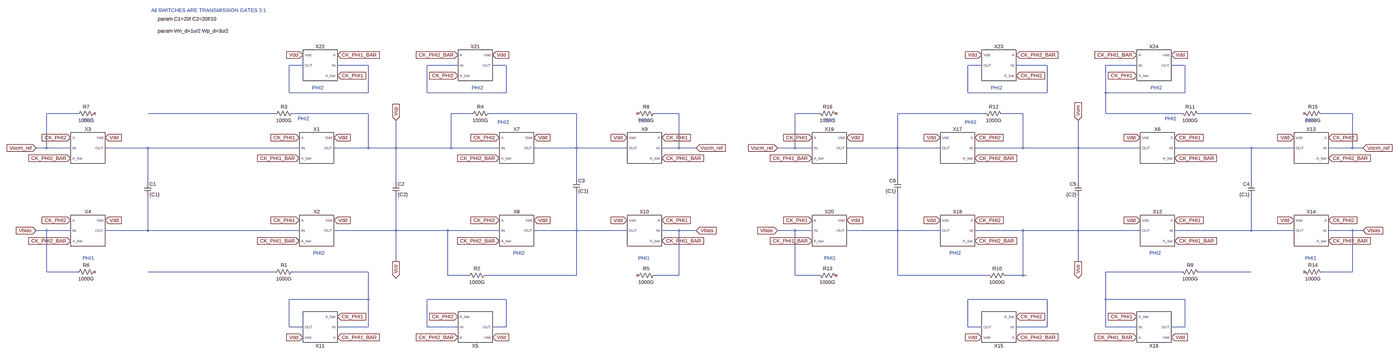
[diagram p0: schematic CS_CMFB_V2.asc, whole sheet]
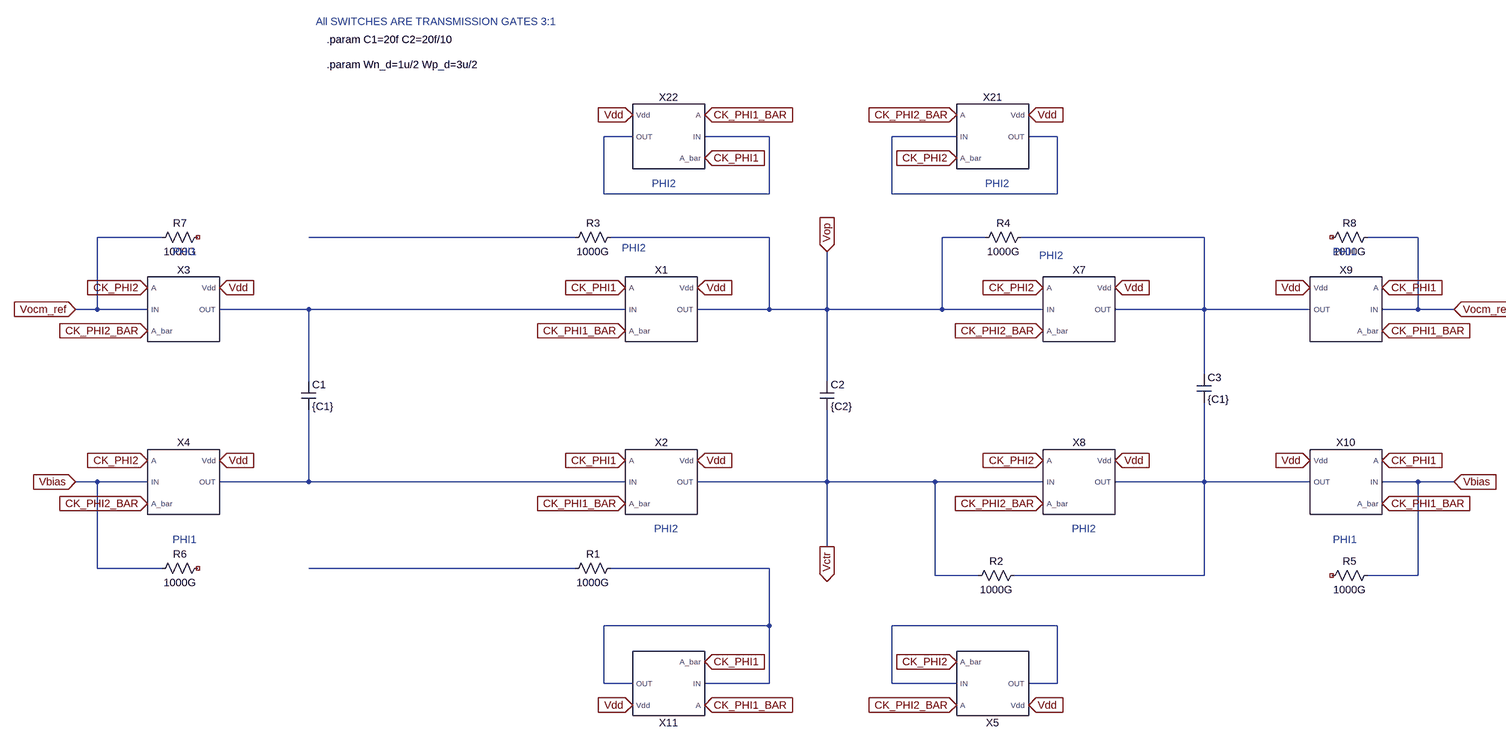
[diagram p1: schematic CS_CMFB_V2.asc, part, row 1 of 1, column 1 of 2]
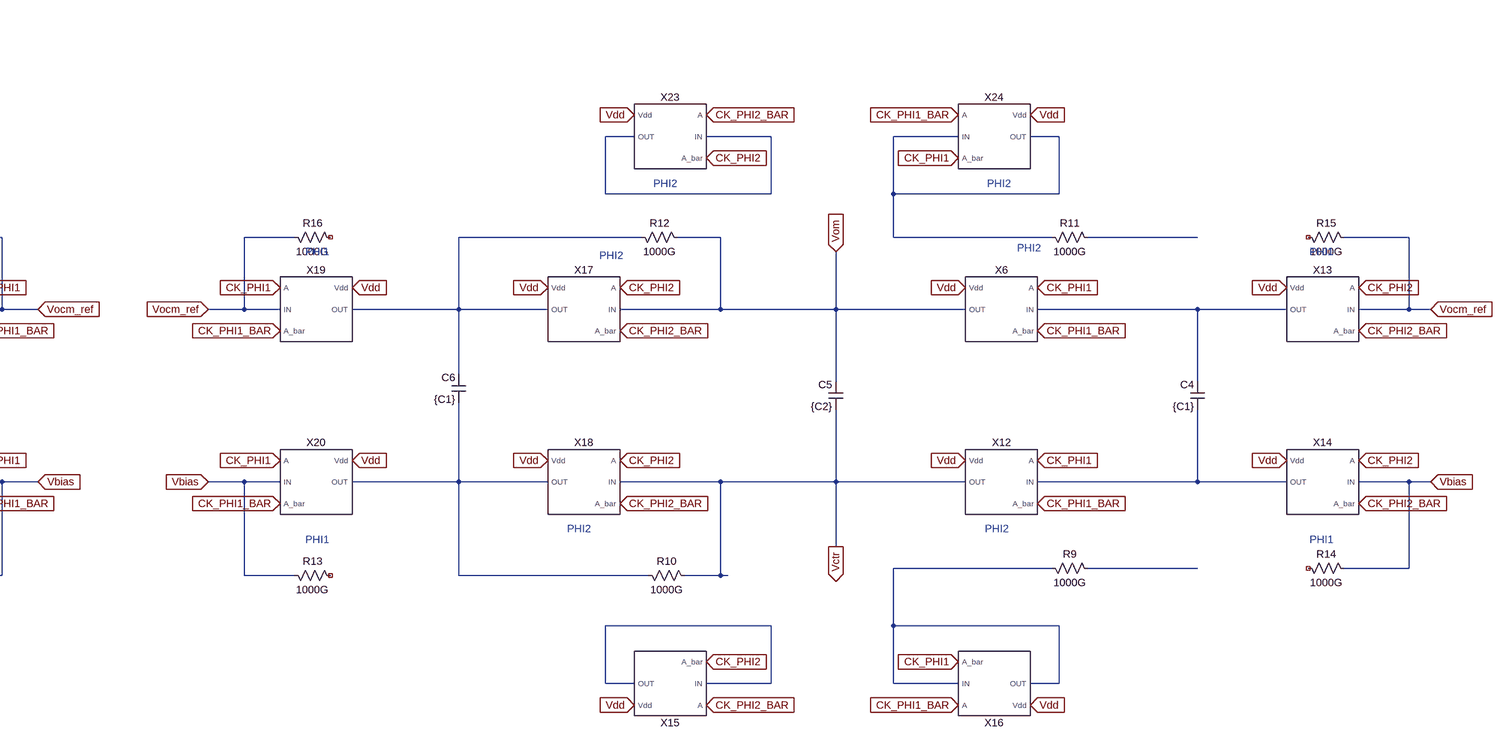
[diagram p2: schematic CS_CMFB_V2.asc, part, row 1 of 1, column 2 of 2]
CS_CMFB_V2.asc, the LTspice schematic file:
Version 4
SHEET 1 4968 1400
WIRE -1040 -368 -1104 -368
WIRE -736 -368 -880 -368
WIRE -320 -368 -464 -368
WIRE -96 -368 -160 -368
WIRE 2672 -368 2608 -368
WIRE 2976 -368 2832 -368
WIRE 3392 -368 3248 -368
WIRE 3616 -368 3552 -368
WIRE -1104 -240 -1104 -368
WIRE -736 -240 -736 -368
WIRE -736 -240 -1104 -240
WIRE -464 -240 -464 -368
WIRE -96 -240 -96 -368
WIRE -96 -240 -464 -240
WIRE 2608 -240 2608 -368
WIRE 2976 -240 2976 -368
WIRE 2976 -240 2608 -240
WIRE 3248 -240 3248 -368
WIRE 3616 -240 3616 -368
WIRE 3616 -240 3248 -240
WIRE -2096 -144 -2240 -144
WIRE -1168 -144 -1760 -144
WIRE -736 -144 -1088 -144
WIRE -256 -144 -352 -144
WIRE 320 -144 -176 -144
WIRE 832 -144 720 -144
WIRE 1792 -144 1680 -144
WIRE 2688 -144 2192 -144
WIRE 2864 -144 2768 -144
WIRE 3248 -144 3248 -240
WIRE 3600 -144 3248 -144
WIRE 4272 -144 3680 -144
WIRE 4752 -144 4608 -144
WIRE -2240 16 -2240 -144
WIRE -2240 16 -2288 16
WIRE -2128 16 -2240 16
WIRE -1760 16 -1968 16
WIRE -1056 16 -1760 16
WIRE -736 16 -736 -144
WIRE -736 16 -896 16
WIRE -608 16 -608 -112
WIRE -608 16 -736 16
WIRE -352 16 -352 -144
WIRE -352 16 -608 16
WIRE -128 16 -352 16
WIRE 320 16 320 -144
WIRE 320 16 32 16
WIRE 592 16 320 16
WIRE 832 16 832 -144
WIRE 832 16 752 16
WIRE 912 16 832 16
WIRE 1680 16 1680 -144
WIRE 1680 16 1600 16
WIRE 1760 16 1680 16
WIRE 2192 16 2192 -144
WIRE 2192 16 1920 16
WIRE 2480 16 2192 16
WIRE 2864 16 2864 -144
WIRE 2864 16 2640 16
WIRE 3120 16 3120 -112
WIRE 3120 16 2864 16
WIRE 3408 16 3120 16
WIRE 4272 16 3568 16
WIRE 4480 16 4272 16
WIRE 4752 16 4752 -144
WIRE 4752 16 4640 16
WIRE 4800 16 4752 16
WIRE 320 160 320 16
WIRE 2192 160 2192 16
WIRE -1760 176 -1760 16
WIRE -608 176 -608 16
WIRE 3120 176 3120 16
WIRE 4272 176 4272 16
WIRE -2240 400 -2288 400
WIRE -2128 400 -2240 400
WIRE -1760 400 -1760 240
WIRE -1760 400 -1968 400
WIRE -1056 400 -1760 400
WIRE -608 400 -608 240
WIRE -608 400 -896 400
WIRE -368 400 -608 400
WIRE -128 400 -368 400
WIRE 320 400 320 224
WIRE 320 400 32 400
WIRE 592 400 320 400
WIRE 832 400 752 400
WIRE 912 400 832 400
WIRE 1680 400 1600 400
WIRE 1760 400 1680 400
WIRE 2192 400 2192 224
WIRE 2192 400 1920 400
WIRE 2480 400 2192 400
WIRE 2864 400 2640 400
WIRE 3120 400 3120 240
WIRE 3120 400 2864 400
WIRE 3408 400 3120 400
WIRE 4272 400 4272 240
WIRE 4272 400 3568 400
WIRE 4480 400 4272 400
WIRE 4752 400 4640 400
WIRE 4800 400 4752 400
WIRE -608 544 -608 400
WIRE 3120 544 3120 400
WIRE -2240 592 -2240 400
WIRE -2096 592 -2240 592
WIRE -1168 592 -1760 592
WIRE -736 592 -1088 592
WIRE 3600 592 3248 592
WIRE 4272 592 3680 592
WIRE 4752 592 4752 400
WIRE 4752 592 4608 592
WIRE -368 608 -368 400
WIRE -272 608 -368 608
WIRE 320 608 320 400
WIRE 320 608 -192 608
WIRE 832 608 832 400
WIRE 832 608 720 608
WIRE 1680 608 1680 400
WIRE 1792 608 1680 608
WIRE 2192 608 2192 400
WIRE 2704 608 2192 608
WIRE 2864 608 2864 400
WIRE 2864 608 2784 608
WIRE 2880 608 2864 608
WIRE -736 720 -736 592
WIRE -736 720 -1104 720
WIRE -96 720 -464 720
WIRE 2976 720 2608 720
WIRE 3248 720 3248 592
WIRE 3616 720 3248 720
WIRE -1104 848 -1104 720
WIRE -1040 848 -1104 848
WIRE -736 848 -736 720
WIRE -736 848 -880 848
WIRE -464 848 -464 720
WIRE -320 848 -464 848
WIRE -96 848 -96 720
WIRE -96 848 -160 848
WIRE 2608 848 2608 720
WIRE 2672 848 2608 848
WIRE 2976 848 2976 720
WIRE 2976 848 2832 848
WIRE 3248 848 3248 720
WIRE 3392 848 3248 848
WIRE 3616 848 3616 720
WIRE 3616 848 3552 848
FLAG -2288 16 Vocm_ref
IOPIN -2288 16 In
FLAG -608 -112 Vop
IOPIN -608 -112 In
FLAG -1968 -32 Vdd
IOPIN -1968 -32 In
FLAG -896 -32 Vdd
IOPIN -896 -32 In
FLAG -896 352 Vdd
IOPIN -896 352 In
FLAG -1968 352 Vdd
IOPIN -1968 352 In
FLAG -2128 -32 CK_PHI2
IOPIN -2128 -32 In
FLAG -2128 352 CK_PHI2
IOPIN -2128 352 In
FLAG -1056 -32 CK_PHI1
IOPIN -1056 -32 In
FLAG -1056 352 CK_PHI1
IOPIN -1056 352 In
FLAG -2128 64 CK_PHI2_BAR
IOPIN -2128 64 In
FLAG -2128 448 CK_PHI2_BAR
IOPIN -2128 448 In
FLAG -1056 64 CK_PHI1_BAR
IOPIN -1056 64 In
FLAG -1056 448 CK_PHI1_BAR
IOPIN -1056 448 In
FLAG -2288 400 Vbias
IOPIN -2288 400 In
FLAG -608 544 Vctr
IOPIN -608 544 Out
FLAG -160 896 Vdd
IOPIN -160 896 In
FLAG -320 896 CK_PHI2_BAR
IOPIN -320 896 In
FLAG -320 800 CK_PHI2
IOPIN -320 800 In
FLAG -1040 896 Vdd
IOPIN -1040 896 In
FLAG -880 896 CK_PHI1_BAR
IOPIN -880 896 In
FLAG -880 800 CK_PHI1
IOPIN -880 800 In
FLAG 32 -32 Vdd
IOPIN 32 -32 In
FLAG 32 352 Vdd
IOPIN 32 352 In
FLAG -128 -32 CK_PHI2
IOPIN -128 -32 In
FLAG -128 352 CK_PHI2
IOPIN -128 352 In
FLAG -128 64 CK_PHI2_BAR
IOPIN -128 64 In
FLAG -128 448 CK_PHI2_BAR
IOPIN -128 448 In
FLAG 912 16 Vocm_ref
IOPIN 912 16 In
FLAG 592 -32 Vdd
IOPIN 592 -32 In
FLAG 592 352 Vdd
IOPIN 592 352 In
FLAG 752 -32 CK_PHI1
IOPIN 752 -32 In
FLAG 752 352 CK_PHI1
IOPIN 752 352 In
FLAG 752 64 CK_PHI1_BAR
IOPIN 752 64 In
FLAG 752 448 CK_PHI1_BAR
IOPIN 752 448 In
FLAG 912 400 Vbias
IOPIN 912 400 In
FLAG -160 -416 Vdd
IOPIN -160 -416 In
FLAG -320 -416 CK_PHI2_BAR
IOPIN -320 -416 In
FLAG -320 -320 CK_PHI2
IOPIN -320 -320 In
FLAG -1040 -416 Vdd
IOPIN -1040 -416 In
FLAG -880 -416 CK_PHI1_BAR
IOPIN -880 -416 In
FLAG -880 -320 CK_PHI1
IOPIN -880 -320 In
FLAG 4800 16 Vocm_ref
IOPIN 4800 16 In
FLAG 3120 -112 Vom
IOPIN 3120 -112 In
FLAG 4480 -32 Vdd
IOPIN 4480 -32 In
FLAG 3408 -32 Vdd
IOPIN 3408 -32 In
FLAG 3408 352 Vdd
IOPIN 3408 352 In
FLAG 4480 352 Vdd
IOPIN 4480 352 In
FLAG 4640 -32 CK_PHI2
IOPIN 4640 -32 In
FLAG 4640 352 CK_PHI2
IOPIN 4640 352 In
FLAG 3568 -32 CK_PHI1
IOPIN 3568 -32 In
FLAG 3568 352 CK_PHI1
IOPIN 3568 352 In
FLAG 4640 64 CK_PHI2_BAR
IOPIN 4640 64 In
FLAG 4640 448 CK_PHI2_BAR
IOPIN 4640 448 In
FLAG 3568 64 CK_PHI1_BAR
IOPIN 3568 64 In
FLAG 3568 448 CK_PHI1_BAR
IOPIN 3568 448 In
FLAG 4800 400 Vbias
IOPIN 4800 400 In
FLAG 3120 544 Vctr
IOPIN 3120 544 Out
FLAG 2672 896 Vdd
IOPIN 2672 896 In
FLAG 2832 896 CK_PHI2_BAR
IOPIN 2832 896 In
FLAG 2832 800 CK_PHI2
IOPIN 2832 800 In
FLAG 3552 896 Vdd
IOPIN 3552 896 In
FLAG 3392 896 CK_PHI1_BAR
IOPIN 3392 896 In
FLAG 3392 800 CK_PHI1
IOPIN 3392 800 In
FLAG 2480 -32 Vdd
IOPIN 2480 -32 In
FLAG 2480 352 Vdd
IOPIN 2480 352 In
FLAG 2640 -32 CK_PHI2
IOPIN 2640 -32 In
FLAG 2640 352 CK_PHI2
IOPIN 2640 352 In
FLAG 2640 64 CK_PHI2_BAR
IOPIN 2640 64 In
FLAG 2640 448 CK_PHI2_BAR
IOPIN 2640 448 In
FLAG 1600 16 Vocm_ref
IOPIN 1600 16 In
FLAG 1920 -32 Vdd
IOPIN 1920 -32 In
FLAG 1920 352 Vdd
IOPIN 1920 352 In
FLAG 1760 -32 CK_PHI1
IOPIN 1760 -32 In
FLAG 1760 352 CK_PHI1
IOPIN 1760 352 In
FLAG 1760 64 CK_PHI1_BAR
IOPIN 1760 64 In
FLAG 1760 448 CK_PHI1_BAR
IOPIN 1760 448 In
FLAG 1600 400 Vbias
IOPIN 1600 400 In
FLAG 2672 -416 Vdd
IOPIN 2672 -416 In
FLAG 2832 -416 CK_PHI2_BAR
IOPIN 2832 -416 In
FLAG 2832 -320 CK_PHI2
IOPIN 2832 -320 In
FLAG 3552 -416 Vdd
IOPIN 3552 -416 In
FLAG 3392 -416 CK_PHI1_BAR
IOPIN 3392 -416 In
FLAG 3392 -320 CK_PHI1
IOPIN 3392 -320 In
SYMBOL tgate -976 16 R0
SYMATTR InstName X1
SYMBOL tgate -976 400 R0
SYMATTR InstName X2
SYMBOL tgate -2048 16 R0
SYMATTR InstName X3
SYMBOL tgate -2048 400 R0
SYMATTR InstName X4
SYMBOL cap -1776 176 R0
SYMATTR InstName C1
SYMATTR Value {C1}
SYMBOL cap -624 176 R0
SYMATTR InstName C2
SYMATTR Value {C2}
SYMBOL tgate -240 848 M180
SYMATTR SpiceLine L=0.28u Wn={Wn_d} Wp={Wp_d} M=1
SYMATTR InstName X5
SYMBOL tgate -960 848 R180
SYMATTR SpiceLine L=0.28u Wn={Wn_d} Wp={Wp_d} M=1
SYMATTR InstName X11
SYMBOL tgate -48 16 R0
SYMATTR InstName X7
SYMBOL tgate -48 400 R0
SYMATTR InstName X8
SYMBOL tgate 672 16 M0
SYMATTR InstName X9
SYMBOL tgate 672 400 M0
SYMATTR InstName X10
SYMBOL cap 304 160 R0
SYMATTR InstName C3
SYMATTR Value {C1}
SYMBOL tgate -240 -368 R0
SYMATTR SpiceLine L=0.28u Wn={Wn_d} Wp={Wp_d} M=1
SYMATTR InstName X21
SYMBOL tgate -960 -368 M0
SYMATTR SpiceLine L=0.28u Wn={Wn_d} Wp={Wp_d} M=1
SYMATTR InstName X22
SYMBOL res -1072 576 R90
WINDOW 0 0 56 VBottom 2
WINDOW 3 32 56 VTop 2
SYMATTR InstName R1
SYMATTR Value 1000G
SYMBOL res -176 592 R90
WINDOW 0 0 56 VBottom 2
WINDOW 3 32 56 VTop 2
SYMATTR InstName R2
SYMATTR Value 1000G
SYMBOL res -1072 -160 R90
WINDOW 0 0 56 VBottom 2
WINDOW 3 32 56 VTop 2
SYMATTR InstName R3
SYMATTR Value 1000G
SYMBOL res -160 -160 R90
WINDOW 0 0 56 VBottom 2
WINDOW 3 32 56 VTop 2
SYMATTR InstName R4
SYMATTR Value 1000G
SYMBOL res 736 592 R90
WINDOW 0 0 56 VBottom 2
WINDOW 3 32 56 VTop 2
SYMATTR InstName R5
SYMATTR Value 1000G
SYMBOL res -2000 576 R90
WINDOW 0 0 56 VBottom 2
WINDOW 3 32 56 VTop 2
SYMATTR InstName R6
SYMATTR Value 1000G
SYMBOL res -2000 -160 R90
WINDOW 0 0 56 VBottom 2
WINDOW 3 32 56 VTop 2
SYMATTR InstName R7
SYMATTR Value 1000G
SYMBOL res 736 -160 R90
WINDOW 0 0 56 VBottom 2
WINDOW 3 32 56 VTop 2
SYMATTR InstName R8
SYMATTR Value 1000G
SYMBOL tgate 3488 16 M0
SYMATTR InstName X6
SYMBOL tgate 3488 400 M0
SYMATTR InstName X12
SYMBOL tgate 4560 16 M0
SYMATTR InstName X13
SYMBOL tgate 4560 400 M0
SYMATTR InstName X14
SYMBOL cap 4288 176 M0
SYMATTR InstName C4
SYMATTR Value {C1}
SYMBOL cap 3136 176 M0
SYMATTR InstName C5
SYMATTR Value {C2}
SYMBOL tgate 2752 848 R180
SYMATTR SpiceLine L=0.28u Wn={Wn_d} Wp={Wp_d} M=1
SYMATTR InstName X15
SYMBOL tgate 3472 848 M180
SYMATTR SpiceLine L=0.28u Wn={Wn_d} Wp={Wp_d} M=1
SYMATTR InstName X16
SYMBOL tgate 2560 16 M0
SYMATTR InstName X17
SYMBOL tgate 2560 400 M0
SYMATTR InstName X18
SYMBOL tgate 1840 16 R0
SYMATTR InstName X19
SYMBOL tgate 1840 400 R0
SYMATTR InstName X20
SYMBOL cap 2208 160 M0
SYMATTR InstName C6
SYMATTR Value {C1}
SYMBOL tgate 2752 -368 M0
SYMATTR SpiceLine L=0.28u Wn={Wn_d} Wp={Wp_d} M=1
SYMATTR InstName X23
SYMBOL tgate 3472 -368 R0
SYMATTR SpiceLine L=0.28u Wn={Wn_d} Wp={Wp_d} M=1
SYMATTR InstName X24
SYMBOL res 3584 576 M90
WINDOW 0 0 56 VBottom 2
WINDOW 3 32 56 VTop 2
SYMATTR InstName R9
SYMATTR Value 1000G
SYMBOL res 2688 592 M90
WINDOW 0 0 56 VBottom 2
WINDOW 3 32 56 VTop 2
SYMATTR InstName R10
SYMATTR Value 1000G
SYMBOL res 3584 -160 M90
WINDOW 0 0 56 VBottom 2
WINDOW 3 32 56 VTop 2
SYMATTR InstName R11
SYMATTR Value 1000G
SYMBOL res 2672 -160 M90
WINDOW 0 0 56 VBottom 2
WINDOW 3 32 56 VTop 2
SYMATTR InstName R12
SYMATTR Value 1000G
SYMBOL res 1776 592 M90
WINDOW 0 0 56 VBottom 2
WINDOW 3 32 56 VTop 2
SYMATTR InstName R13
SYMATTR Value 1000G
SYMBOL res 4512 576 M90
WINDOW 0 0 56 VBottom 2
WINDOW 3 32 56 VTop 2
SYMATTR InstName R14
SYMATTR Value 1000G
SYMBOL res 4512 -160 M90
WINDOW 0 0 56 VBottom 2
WINDOW 3 32 56 VTop 2
SYMATTR InstName R15
SYMATTR Value 1000G
SYMBOL res 1776 -160 M90
WINDOW 0 0 56 VBottom 2
WINDOW 3 32 56 VTop 2
SYMATTR InstName R16
SYMATTR Value 1000G
TEXT -1064 -120 Left 2 ;PHI2
TEXT -992 504 Left 2 ;PHI2
TEXT -2072 -112 Left 2 ;PHI1
TEXT -2072 528 Left 2 ;PHI1
TEXT -1720 -584 Left 2 !.param C1=20f C2=20f/10
TEXT -1744 -624 Left 2 ;All SWITCHES ARE TRANSMISSION GATES 3:1
TEXT -1720 -528 Left 2 !.param Wn_d=1u/2 Wp_d=3u/2
TEXT -136 -104 Left 2 ;PHI2
TEXT -64 504 Left 2 ;PHI2
TEXT 696 -112 Right 2 ;PHI1
TEXT 696 528 Right 2 ;PHI1
TEXT -256 -264 Left 2 ;PHI2
TEXT -944 -264 Right 2 ;PHI2
TEXT 3576 -120 Right 2 ;PHI2
TEXT 3504 504 Right 2 ;PHI2
TEXT 4584 -112 Right 2 ;PHI1
TEXT 4584 528 Right 2 ;PHI1
TEXT 2648 -104 Right 2 ;PHI2
TEXT 2576 504 Right 2 ;PHI2
TEXT 1816 -112 Left 2 ;PHI1
TEXT 1816 528 Left 2 ;PHI1
TEXT 2768 -264 Right 2 ;PHI2
TEXT 3456 -264 Left 2 ;PHI2

The netlist it stands for:
* CS_CMFB_V2.asc
XX1 CK_PHI1 CK_PHI1_BAR N009 Vdd Vop tgate L=0.28u Wn=1u Wp=3u M=1  ; pins A A_bar IN Vdd OUT
XX2 CK_PHI1 CK_PHI1_BAR N011 Vdd Vctr tgate L=0.28u Wn=1u Wp=3u M=1  ; pins A A_bar IN Vdd OUT
XX3 CK_PHI2 CK_PHI2_BAR Vocm_ref Vdd N009 tgate L=0.28u Wn=1u Wp=3u M=1  ; pins A A_bar IN Vdd OUT
XX4 CK_PHI2 CK_PHI2_BAR Vbias Vdd N011 tgate L=0.28u Wn=1u Wp=3u M=1  ; pins A A_bar IN Vdd OUT
C1 N009 N011 {C1}
C2 Vop Vctr {C2}
XX5 CK_PHI2_BAR CK_PHI2 N019 Vdd N019 tgate L=0.28u Wn={Wn_d} Wp={Wp_d} M=1  ; pins A A_bar IN Vdd OUT
XX11 CK_PHI1_BAR CK_PHI1 N016 Vdd N016 tgate L=0.28u Wn={Wn_d} Wp={Wp_d} M=1  ; pins A A_bar IN Vdd OUT
XX7 CK_PHI2 CK_PHI2_BAR Vop Vdd N006 tgate L=0.28u Wn=1u Wp=3u M=1  ; pins A A_bar IN Vdd OUT
XX8 CK_PHI2 CK_PHI2_BAR Vctr Vdd N012 tgate L=0.28u Wn=1u Wp=3u M=1  ; pins A A_bar IN Vdd OUT
XX9 CK_PHI1 CK_PHI1_BAR Vocm_ref Vdd N006 tgate L=0.28u Wn=1u Wp=3u M=1  ; pins A A_bar IN Vdd OUT
XX10 CK_PHI1 CK_PHI1_BAR Vbias Vdd N012 tgate L=0.28u Wn=1u Wp=3u M=1  ; pins A A_bar IN Vdd OUT
C3 N006 N012 {C1}
XX21 CK_PHI2_BAR CK_PHI2 N002 Vdd N002 tgate L=0.28u Wn={Wn_d} Wp={Wp_d} M=1  ; pins A A_bar IN Vdd OUT
XX22 CK_PHI1_BAR CK_PHI1 N001 Vdd N001 tgate L=0.28u Wn={Wn_d} Wp={Wp_d} M=1  ; pins A A_bar IN Vdd OUT
R1 N016 N015 1000G
R2 N012 Vctr 1000G
R3 Vop N005 1000G
R4 N006 Vop 1000G
R5 Vbias NC_01 1000G
R6 NC_02 Vbias 1000G
R7 NC_03 Vocm_ref 1000G
R8 Vocm_ref NC_04 1000G
XX6 CK_PHI1 CK_PHI1_BAR N010 Vdd Vom tgate L=0.28u Wn=1u Wp=3u M=1  ; pins A A_bar IN Vdd OUT
XX12 CK_PHI1 CK_PHI1_BAR N014 Vdd Vctr tgate L=0.28u Wn=1u Wp=3u M=1  ; pins A A_bar IN Vdd OUT
XX13 CK_PHI2 CK_PHI2_BAR Vocm_ref Vdd N010 tgate L=0.28u Wn=1u Wp=3u M=1  ; pins A A_bar IN Vdd OUT
XX14 CK_PHI2 CK_PHI2_BAR Vbias Vdd N014 tgate L=0.28u Wn=1u Wp=3u M=1  ; pins A A_bar IN Vdd OUT
C4 N010 N014 {C1}
C5 Vom Vctr {C2}
XX15 CK_PHI2_BAR CK_PHI2 N020 Vdd N020 tgate L=0.28u Wn={Wn_d} Wp={Wp_d} M=1  ; pins A A_bar IN Vdd OUT
XX16 CK_PHI1_BAR CK_PHI1 N017 Vdd N017 tgate L=0.28u Wn={Wn_d} Wp={Wp_d} M=1  ; pins A A_bar IN Vdd OUT
XX17 CK_PHI2 CK_PHI2_BAR Vom Vdd N007 tgate L=0.28u Wn=1u Wp=3u M=1  ; pins A A_bar IN Vdd OUT
XX18 CK_PHI2 CK_PHI2_BAR Vctr Vdd N013 tgate L=0.28u Wn=1u Wp=3u M=1  ; pins A A_bar IN Vdd OUT
XX19 CK_PHI1 CK_PHI1_BAR Vocm_ref Vdd N007 tgate L=0.28u Wn=1u Wp=3u M=1  ; pins A A_bar IN Vdd OUT
XX20 CK_PHI1 CK_PHI1_BAR Vbias Vdd N013 tgate L=0.28u Wn=1u Wp=3u M=1  ; pins A A_bar IN Vdd OUT
C6 N007 N013 {C1}
XX23 CK_PHI2_BAR CK_PHI2 N003 Vdd N003 tgate L=0.28u Wn={Wn_d} Wp={Wp_d} M=1  ; pins A A_bar IN Vdd OUT
XX24 CK_PHI1_BAR CK_PHI1 N004 Vdd N004 tgate L=0.28u Wn={Wn_d} Wp={Wp_d} M=1  ; pins A A_bar IN Vdd OUT
R9 N017 N018 1000G
R10 N013 Vctr 1000G
R11 N004 N008 1000G
R12 N007 Vom 1000G
R13 Vbias NC_05 1000G
R14 NC_06 Vbias 1000G
R15 NC_07 Vocm_ref 1000G
R16 Vocm_ref NC_08 1000G
* PHI2
* PHI2
* PHI1
* PHI1
.param C1=20f C2=20f/10
* All SWITCHES ARE TRANSMISSION GATES 3:1
.param Wn_d=1u/2 Wp_d=3u/2
* PHI2
* PHI2
* PHI1
* PHI1
* PHI2
* PHI2
* PHI2
* PHI2
* PHI1
* PHI1
* PHI2
* PHI2
* PHI1
* PHI1
* PHI2
* PHI2
.backanno
.end